# EasyEDA Pro project ProPrj_ST-Link_2025-02-09.epro, board ST-LINK_v1
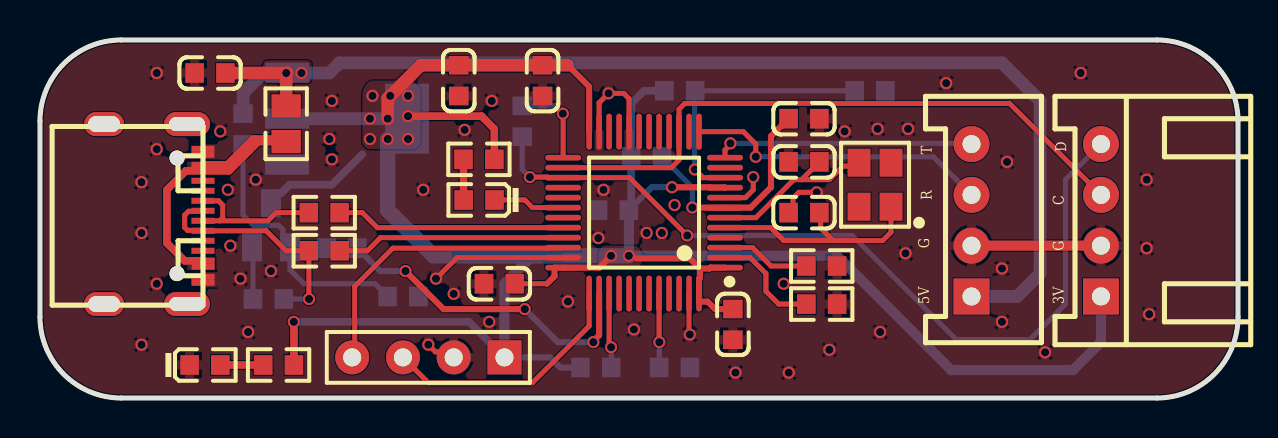
[diagram p5: board, top side]
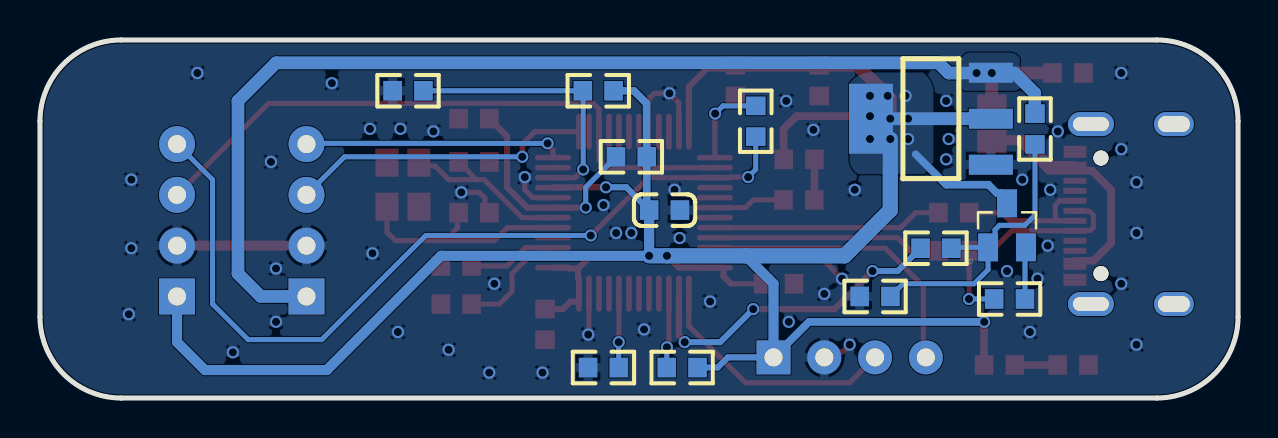
[diagram p6: board, bottom side, seen from below]

Outline 59.94 x 17.91 mm; copper layers: Top Layer, Bottom Layer. Coordinates in mm from the lower left corner of the outline.
Outline path: 0,13.84 0,4.06 arc(1.19,1.19) 4.06,0 55.88,0 arc(58.75,1.19) 59.94,4.06 59.94,13.84 arc(58.75,16.72) 55.88,17.91 4.06,17.91 arc(1.19,16.72) 0,13.84
Stack: Top Layer 0.0356mm / Dielectric 1 0.32mm FR-4 er 4.8 / Bottom Layer 0.0356mm

## Design rules (mm)
net C2: ST-LINK
net C3: ST-LINK
net C4: ST-LINK
net C5: ST-LINK
net C6: ST-LINK
net C7: ST-LINK
net C8: ST-LINK
net C9: ST-LINK
net D1: ST-LINK
net D2: ST-LINK
net F1: ST-LINK
net H1: ST-LINK
net P1: ST-LINK
net P3: ST-LINK
net P4: ST-LINK
net Q: ST-LINK
net R1: ST-LINK
net R2: ST-LINK
net R3: ST-LINK
net R4: ST-LINK
net R5: ST-LINK
net R6: ST-LINK
net R7: ST-LINK
net R8: ST-LINK
net R9: ST-LINK
net R10: ST-LINK
net R11: ST-LINK
net R12: ST-LINK
net R13: ST-LINK
net R14: ST-LINK
net R15: ST-LINK
net R16: ST-LINK
net U1: ST-LINK
net VR1: ST-LINK
net Y1: ST-LINK
net C1: ST-LINK
spacing Clearance (default): track to track 0.152, other pairs 0.152 to 0.152
track width Width (default): min 0.203, default 0.254, max 1.27
differential pair DiffPairsRouting (default): width min 0.381, default 0.381, max 0.381; gap min 0.254, default 0.254
via RoutingVias (default): diameter min 0.61, default 0.711, max 1.016; hole min 0.305, default 0.406, max 0.61

## Placement (name value [footprint] x y rotation side)
C1  100nF  [0603_C]  25.15 15.88 90 top
C2  100nF  [0603_C]  22.99 5.72 0 top
C3  100nF  [0603_C]  28.69 9.4 0 bottom
C4  100nF  [0603_C]  34.67 3.68 90 top
C5  22pF  [0603_C]  38.23 9.27 180 top
C6  22pF  [0603_C]  38.23 11.81 180 top
C7  10uF  [0603_C]  8.51 16.26 180 top
C8  10uF  [0603_C]  20.95 15.88 90 top
C9  100nF  [0603_C]  38.23 13.97 180 top
D1  蓝灯  [0603_LED_S1]  8.26 1.65 0 top
D2  黄灯  [0603_LED_S1]  21.97 9.91 180 top
F1  自恢复保险/1A  [0805_R]  12.32 13.72 90 top
H1  排针  [HDR2.54-LI-4P]  19.43 2.03 180 top
P1  TYPE_C  [Type-C_16P]  8.16 9.36 0 top
P3  XH2.54-4P卧式  [XH2.54_4P卧式]  53.09 8.89 90 top
P4  XH2.54-4P立式  [XH2.54_4P立式]  46.61 8.89 90 top
Q  *  [SOT95P240X120-3N]  11.56 8.64 180 bottom
R1  10KΩ  [0603_R]  39.12 4.7 180 top
R2  10KΩ  [0603_R]  39.12 6.6 180 top
R3  100Ω  [0603_R]  24.13 13.84 90 bottom
R4  4.7KΩ  [0603_R]  27.81 1.52 180 bottom
R5  100KΩ  [0603_R]  31.75 1.52 0 bottom
R6  1KΩ  [0603_R]  11.94 1.65 180 top
R7  1KΩ  [0603_R]  21.96 11.94 180 top
R8  22Ω  [0603_R]  14.22 9.27 0 top
R9  22Ω  [0603_R]  14.22 7.37 0 top
R10  1.5KΩ  [0603_R]  11.43 4.95 0 bottom
R11  10KΩ  [0603_R]  10.16 13.45 90 bottom
R12  100Ω  [0603_R]  15.11 7.49 0 bottom
R13  36KΩ  [0603_R]  18.16 5.08 180 bottom
R14  10KΩ  [0603_R]  30.35 12.06 180 bottom
R15  10KΩ  [0603_R]  32.01 15.37 180 bottom
R16  10KΩ  [0603_R]  41.53 15.37 180 bottom
U1  -  [STM32F103C8T6]  30.23 9.27 90 top
VR1  AMS1117-3.3  [SOT-223]  15.37 13.97 180 bottom
Y1  8MHZ  10PPM  [SMD-3225_4P]  41.78 10.67 90 top

## Footprints (pads in the part's own frame, mm; a bottom-side part is the same pattern mirrored in y, then rotated)
0603_C
  rect 0.93x0.98 smd: 1(-0.77,0) 2(0.77,0)
0603_LED_S1
  rect 0.93x0.98 smd: A(0.77,0) K(-0.77,0)
0603_R
  rect 0.93x0.98 smd: 1(-0.77,0) 2(0.77,0)
0805_R
  rect 1.16x1.47 smd: 1(-0.89,0) 2(0.89,0)
HDR2.54-LI-4P
  rect 1.7x1.7 hole 0.9: 1(-3.81,0)
  round 1.7 hole 0.9: 2(-1.27,0) 3(1.27,0) 4(3.81,0)
SMD-3225_4P
  rect 1.4x1.15 smd: 1(-1.1,-0.8) 2(1.1,-0.8) 3(1.1,0.8) 4(-1.1,0.8)
SOT95P240X120-3N
  rect 1x1.4 smd: 1(-0.95,-1.1) 2(0.95,-1.1) 3(0,1.1)
SOT-223
  rect 2.2x1 smd: 1(3,-2.3) 2(3,0) 3(3,2.3)
  rect 2.2x3.5 smd: 2(-3,0)
STM32F103C8T6
  oval 0.28x1.8 smd: 1(-2.75,-4.05) 2(-2.25,-4.05) 3(-1.75,-4.05) 4(-1.25,-4.05) 5(-0.75,-4.05) 6(-0.25,-4.05) 7(0.25,-4.05) 8(0.75,-4.05) 9(1.25,-4.05) 10(1.75,-4.05) 11(2.25,-4.05) 12(2.75,-4.05) 25(2.75,4.05) 26(2.25,4.05) 27(1.75,4.05) 28(1.25,4.05) 29(0.75,4.05) 30(0.25,4.05) 31(-0.25,4.05) 32(-0.75,4.05) 33(-1.25,4.05) 34(-1.75,4.05) 35(-2.25,4.05) 36(-2.75,4.05)
  oval 1.8x0.28 smd: 13(4.05,-2.75) 14(4.05,-2.25) 15(4.05,-1.75) 16(4.05,-1.25) 17(4.05,-0.75) 18(4.05,-0.25) 19(4.05,0.25) 20(4.05,0.75) 21(4.05,1.25) 22(4.05,1.75) 23(4.05,2.25) 24(4.05,2.75) 37(-4.05,2.75) 38(-4.05,2.25) 39(-4.05,1.75) 40(-4.05,1.25) 41(-4.05,0.75) 42(-4.05,0.25) 43(-4.05,-0.25) 44(-4.05,-0.75) 45(-4.05,-1.25) 46(-4.05,-1.75) 47(-4.05,-2.25) 48(-4.05,-2.75)
Type-C_16P
  round 0.75 hole 0.75: (-1.3,2.64) (-1.3,-3.14)
  oval 2x1.2 hole 1.6x0.8: 0(-4.95,4.338) 0(-4.95,-4.662)
  oval 2.3x1.2 hole 1.8x0.7: 0(-0.8,4.338) 0(-0.8,-4.662)
  rect 1.15x0.3 smd: A1(-0.002,3.1) A4(-0.004,2.3) A5(0,1) A6(0,0) A7(-0.002,-0.5) A8(0,1.5) A9(0,-2.8) A12(0,-3.6) B1(0,-3.3) B4(0,-2.5) B5(0,-2) B6(0,-1) B7(-0.002,0.5) B8(0,-1.5) B9(-0.004,2) B12(-0.002,2.8)
XH2.54_4P卧式
  rect 1.8x1.8 hole 0.9: 1(-3.81,0)
  round 1.8 hole 0.9: 2(-1.27,0) 3(1.27,0) 4(3.81,0)
XH2.54_4P立式
  rect 1.8x1.8 hole 0.9: 1(-3.81,0)
  round 1.8 hole 0.9: 2(-1.27,0) 3(1.27,0) 4(3.81,0)

## Nets
As in the schematic, except:
GND: C1.1 C2.1 C3.1 C4.1 C5.2 C6.2 C7.2 C8.1 C9.1 D1.K H1.2 P1.A1 P1.A12 P1.B1 P1.B12 P3.2 P4.2 R1.1 R2.1 R5.2 R13.1 R16.1 U1.8 U1.20 U1.23 U1.35 U1.47 VR1.1
VBUS: F1.1 P1.A4 P1.A9 P1.B4 P1.B9
USB_DM: P1.A7 P1.B7 R8.1
USB_DP: P1.A6 P1.B6 R9.1 R10.2

Pads without a net: P1 0 A5 A8 B5 B8; U1 4 11 14 16 17 18 19 21 22 28 29 31 40 41 42 43 45 46; Y1 2 4

## Via types
v1: diameter 0.61, hole 0.406, Top Layer to Bottom Layer, 80 vias

## Routing (per net, layer and track width the routed paths; a pad name or vN(x,y) marks a point on that pad's centre or on a via; arc(x,y) is an arc through that point)
GND: length 26.1
  Top Layer w0.254: v1(32.51,3.17) 32.48,3.21 U1.47 ; v1(19.43,2.67) 19.79,2.31 20.42,2.31 H1.2 ; U1.20 29.48,14.97 29.21,15.24 v1(28.45,15.24) 27.98,14.77 U1.23 ; v1(19.81,5.97) 20.86,7.02 U1.35 ; U1.8 35.29,10.02 35.69,10.41 v1(35.69,11.05) ; v1(38.86,10.29) 37.97,10.29 37.68,9.99 37.68,9.49 C5.2
  Top Layer w0.508: P4.2 P3.2
  vias: v1(5.08,10.8) v1(5.08,8.25) v1(5.08,2.67) v1(5.84,16.26) v1(5.84,12.45) v1(5.84,5.72) v1(9.02,13.33) v1(9.4,10.41) v1(9.52,7.62) v1(10.03,5.97) v1(10.41,3.3) v1(10.8,10.92) v1(11.56,6.35) v1(14.48,12.95) v1(14.61,14.86) v1(14.61,11.94) v1(19.18,10.41) v1(20.7,5.21) v1(21.25,13.41) v1(22.48,3.81) v1(22.61,14.86) v1(26.42,4.83) v1(27.94,8) v1(28.19,10.41) v1(29.72,3.43) v1(30.35,8.25) v1(31.11,8.25) v1(31.75,9.65) v1(34.8,1.27) v1(37.21,5.72) v1(37.47,1.27) v1(39.5,2.41) v1(40.26,13.33) v1(41.91,13.46) v1(42.04,3.3) v1(43.31,7.24) v1(43.43,13.46) v1(45.34,15.75) v1(48.13,6.48) v1(48.13,3.81) v1(48.39,11.81) v1(50.29,2.29) v1(52.07,16.26) v1(55.37,10.92) v1(55.37,7.49) v1(55.5,4.19)
VBUS: length 16.6
  Top Layer w0.381: P1.A4 9.38,11.66 10.67,12.95 12.19,12.95 F1.1 10.92,12.83 9.46,11.36 P1.B9 7.3,11.36 6.35,10.41 6.35,7.75 7.23,6.86 P1.B4
AIN: length 13.6
  Top Layer w0.254: v1(32.77,11.43) 33.17,11.02 U1.10
  Bottom Layer w0.254: v1(32.77,11.43) 32.77,15.35 32.78,15.37 R16.2
DC_3.3V: length 129.9
  Top Layer w0.254: C2.2 25.37,5.72
  Top Layer w0.305: 33.02,6.48 32.51,6.98 29.85,6.98 ; 33.02,6.48 33.02,6 32.98,5.96 U1.48 32.98,4.83 32.99,4.82 33.41,4.82 33.78,4.44 34.66,4.44 C4.2 ; 33.02,6.48 33.5,6.48 33.54,6.52 U1.1 ; v1(31.62,10.54) 33.5,10.54 33.5,10.53 34.26,10.53 U1.9 ; U1.24 27.48,15.58 26.41,16.64 ; 25.37,5.72 25.75,6.09 25.75,6.51 25.76,6.52 U1.36 27.98,6.52 v1(28.58,7.11)
  Top Layer w0.381: v1(12.7,3.81) 12.7,3.8 12.71,3.8 R6.1 ; v1(18.42,14.1) 22.1,14.1 22.73,13.46 R7.1
  Top Layer w0.635: v1(17.4,13.97) 17.4,14.99 v1(17.53,15.11) 19.06,16.64 C8.2 C1.2 26.41,16.64
  Top Layer w0.762: P3.1 arc(52.94,4.87) 52.9,4.62
  Bottom Layer w0.305: H1.1 25.53,2.03 26.04,1.52 R4.2 ; 29.58,9.52 30.61,10.54 v1(31.62,10.54)
  Bottom Layer w0.381: Q.3 11.56,9.94 11.87,10.25 12.07,10.25 12.49,10.67 14.61,10.67 16.13,12.19 ; R15.2 30.23,15.37 29.59,14.73 29.59,12.07 R14.2 29.58,9.52 C3.2 ; v1(12.7,3.81) 21.46,3.81 H1.1
  Bottom Layer w0.508: C3.2 v1(29.46,7.11) 39.88,7.11 45.59,1.4 51.69,1.4 53.09,2.79 P3.1 ; 24.64,7.11 23.24,5.72 H1.1
  Bottom Layer w0.635: VR1.2 v1(17.4,13.97) v1(16.51,13.97) VR1.2
  Bottom Layer w0.762: v1(29.46,7.11) v1(28.58,7.11) 19.69,7.11 17.4,9.4 v1(17.4,12.95)
  vias: v1(16.51,12.95) v1(16.64,15.11) v1(18.42,15.11) v1(18.42,12.95)
DC_5V: length 57.7
  Top Layer w0.635: F1.2 12.32,16.15 arc(12.33,16.22) VR1.3 ; C7.1 v1(12.32,16.26)
  Bottom Layer w0.635: P4.1 48.89,5.08 50.04,6.22 50.04,14.86 48.13,16.76 14.99,16.76 14.48,16.26 v1(13.08,16.26) ; R11.2 10.17,14.23 10.17,15.25 11.18,16.26
LED: length 3.6
  Top Layer w0.254: U1.30 26.17,9.53 24.64,9.53 24.26,9.91 D2.K
NETD1_A: length 2.1
  Top Layer w0.381: D1.A R6.2
NETD2_A: length 2
  Top Layer w0.381: D2.A 21.19,9.91 R7.2
NETQ_1: length 15.3
  Bottom Layer w0.254: Q.1 14.3,7.54 R12.1 ; Q.1 12.16,7.89 12.16,8.42 11.94,8.64 10.67,8.64 10.16,9.14 R11.1 ; Q.1 12.51,6.42 13.21,5.72 16.76,5.72 17.03,5.44 17.05,5.44 17.39,5.11 R13.2
NETQ_2: length 2.6
  Bottom Layer w0.254: 10.66,4.95 10.66,7.48 Q.2
NETR1_2: length 5.6
  Top Layer w0.254: U1.2 35.52,7.02 36.32,6.22 36.32,5.33 36.96,4.7 R1.2
NETR2_2: length 4.4
  Top Layer w0.254: R2.2 36.58,6.6 35.66,7.52 U1.3
NETR3_2: length 4.4
  Top Layer w0.254: v1(26.16,14.22) 26.18,14.21 U1.25
  Bottom Layer w0.254: v1(26.16,14.22) 25.77,14.61 R3.2
NETR4_1: length 3.8
  Top Layer w0.254: v1(28.58,2.54) 28.58,2.58 28.48,2.68 U1.39
  Bottom Layer w0.254: v1(28.58,2.54) 28.58,2.53 R4.1 28.57,1.54
NETR5_1: length 3.7
  Top Layer w0.254: v1(30.99,2.79) 30.98,2.81 U1.44
  Bottom Layer w0.254: v1(30.99,2.79) 30.99,1.53 R5.1
OSC_IN: length 11.7
  Top Layer w0.254: 39.06,9.21 39.06,8.5 39.69,7.87 ; 39.69,7.87 37.21,7.87 36.56,8.52 U1.5 ; 39.69,7.87 42.16,7.87 42.58,8.29 Y1.1
  Top Layer w0.305: C5.1 39.06,9.21
OSC_OUT: length 9.4
  Top Layer w0.254: 38.84,11.65 C6.1 39,11.79 38.66,11.45 38.63,11.45 38.11,10.92 ; U1.6 35.82,9.02 37.72,10.92 38.11,10.92 ; 38.11,10.92 39.5,10.92 40.18,11.6 40.94,11.6 40.98,11.64 Y1.3
RESET: length 11.3
  Top Layer w0.305: C9.2 37.46,13.94 37.14,13.63 37.12,13.63 36.58,13.09 36.58,10.54 35.56,9.52 U1.7 32.64,9.52 v1(32.64,9.53)
  Bottom Layer w0.254: 31.45,11.73 32.64,10.54 v1(32.64,9.53)
  Bottom Layer w0.305: 31.45,11.73 31.44,11.73 31.12,12.04 R14.1
STLK_RX: length 15.3
  Top Layer w0.254: U1.13 35.19,13.32 35.81,12.7 v1(35.81,12.06)
  Bottom Layer w0.254: v1(35.81,12.06) 44.7,12.06 P4.3
STLK_TX: length 12.9
  Top Layer w0.254: U1.12 34.28,12.41 34.54,12.68 v1(34.54,12.74)
  Bottom Layer w0.254: P4.4 46.57,12.74 v1(34.54,12.74)
SWCLK: length 12.6
  Top Layer w0.254: H1.3 19.43,0.76 24.64,0.76 27.48,3.6 U1.37
SWDIO: length 14.8
  Top Layer w0.254: H1.4 15.75,2.16 15.75,5.59 17.65,7.49 25.38,7.49 25.41,7.52 U1.34
T_JTCK: length 31.6
  Top Layer w0.254: P3.3 48.51,14.74 48.5,14.73 39.58,14.73 39.58,14.74 36.88,14.74 36.87,14.73 32.26,14.73 31.98,14.45 U1.15 31.98,11.91 31.59,11.52 U1.26
T_JTMS: length 41.8
  Top Layer w0.254: v1(32.39,8.13) 29.49,11.02 U1.27 25.41,11.02 25.38,11.05 v1(24.51,11.05)
  Bottom Layer w0.254: 24.13,13.07 24.13,11.43 v1(24.51,11.05) ; P3.4 51.31,10.92 51.31,4.7 49.53,2.92 45.85,2.92 40.64,8.13 v1(32.39,8.13)
USB_DM: length 7.9
  Top Layer w0.254: P1.A7 8.99,8.86 ; 8.99,8.86 11.4,8.86 11.81,9.27 R8.1 13.45,9.3 13.79,9.63 ; 8.99,8.86 9.14,9.02 9.14,9.65 8.93,9.86 P1.B7
USB_DP: length 12
  Top Layer w0.254: P1.A6 8.14,9.34 7.44,9.34 7.24,9.14 7.24,8.53 7.39,8.38 8.14,8.38 P1.B6 11.32,8.36 12.32,7.37 R9.1 13.45,4.96 v1(13.46,4.95)
  Bottom Layer w0.254: R10.2 v1(13.46,4.95)
USB_M: length 11.5
  Top Layer w0.254: U1.32 16.88,8.52 16.13,9.27 R8.2
USB_P: length 11.5
  Top Layer w0.254: U1.33 17.04,8.02 16.38,7.37 R9.2
USB_RENU: length 16.3
  Top Layer w0.305: v1(18.29,6.35) 20.19,4.44 v1(24.26,4.44) ; U1.38 27.98,3.14 27.69,2.85 v1(27.69,2.79)
  Bottom Layer w0.305: v1(27.69,2.79) 25.91,2.79 v1(24.26,4.44) ; v1(18.29,6.35) 17.03,6.35 16.22,7.16 16.2,7.16 15.88,7.47 R12.2

## Copper pours and planes (outline as drawn; the poured copper is in the pictures)
GND on Top Layer: -1.27,19.3 -1.02,19.05 -1.02,-2.79 61.6,-2.79 62.1,-2.29 61.34,-1.52 61.34,19.56
GND on Bottom Layer: -1.65,20.45 -1.65,-4.32 -1.4,-4.06 66.42,-4.06 66.42,16.76 63.88,19.3
DC_3.3V on Top Layer: 27.94,7.62 30.1,7.62 30.1,6.48 27.94,6.48
DC_3.3V on Top Layer: 16.13,15.88 19.05,15.88 19.05,12.45 16.13,12.45
DC_3.3V on Bottom Layer: 15.24,16.28 19.43,16.28 19.43,11.2 15.24,11.2
DC_5V on Top Layer: 11.18,16.89 13.59,16.89 13.59,15.75 11.18,15.75
DC_5V on Bottom Layer: 10.92,17.27 13.84,17.27 13.84,15.37 10.92,15.37

Small or netless copper shapes (teardrops, artwork), in the pictures only: 2 on Top Layer

## Text on the board
Top Silkscreen Layer: G | 5V | T | R | C | 3V | D
